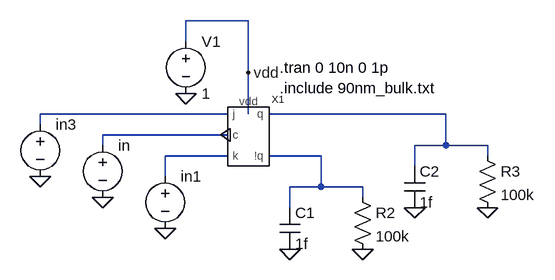
[diagram p0: schematic jk-front-test.asc]
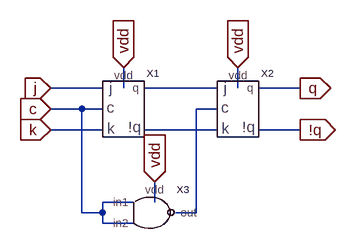
[diagram p1: sub-circuit jk-front-trigger.asc]
jk-front-test.asc, the LTspice schematic file:
Version 4
SHEET 1 2620 680
WIRE 224 0 128 0
WIRE 128 32 128 0
WIRE 224 80 224 0
WIRE 192 144 -96 144
WIRE 224 144 224 80
WIRE 528 144 256 144
WIRE -96 160 -96 144
WIRE 192 176 0 176
WIRE 0 192 0 176
WIRE 528 192 528 144
WIRE 528 192 480 192
WIRE 592 192 528 192
WIRE 192 208 96 208
WIRE 336 208 256 208
WIRE 592 208 592 192
WIRE 480 224 480 192
WIRE 96 240 96 208
WIRE 336 256 336 208
WIRE 336 256 288 256
WIRE 400 256 336 256
WIRE 400 272 400 256
WIRE 288 288 288 256
FLAG 0 272 0
FLAG 288 352 0
FLAG 400 352 0
FLAG 480 288 0
FLAG 592 288 0
FLAG 224 80 vdd
FLAG -96 240 0
FLAG 96 320 0
FLAG 128 112 0
SYMBOL voltage 0 176 R0
WINDOW 123 0 0 Left 2
WINDOW 39 0 0 Left 2
WINDOW 3 22 116 Invisible 2
SYMATTR Value PULSE(0 1 0.5n 10p 10p 1n 2n)
SYMATTR InstName in
SYMBOL res 384 256 R0
SYMATTR InstName R2
SYMATTR Value 100k
SYMBOL cap 272 288 R0
SYMATTR InstName C1
SYMATTR Value 1f
SYMBOL res 576 192 R0
SYMATTR InstName R3
SYMATTR Value 100k
SYMBOL cap 464 224 R0
SYMATTR InstName C2
SYMATTR Value 1f
SYMBOL voltage -96 144 R0
WINDOW 123 0 0 Left 2
WINDOW 39 0 0 Left 2
WINDOW 3 -275 -32 Invisible 2
SYMATTR Value PWL(0n 1 0.01n 1 1n 1 1.01n 0 2n 0 2.01n 0 3n 0 3.01n 0 4n 0 4.01n 0 5n 0 5.01n 1 6n 1 6.01n 0 7n 0 7.01n 1 8n 1 8.01n 1 9n 1 9.01n 0 10n 0 10.01n 0)
SYMATTR InstName in3
SYMBOL voltage 96 224 R0
WINDOW 123 0 0 Left 2
WINDOW 39 0 0 Left 2
WINDOW 3 -21 145 Invisible 2
SYMATTR Value PWL(0n 0 0.01n 0 1n 0 1.01n 0 2n 0 2.01n 0 3n 0 3.01n 1 4n 1 4.01n 0 5n 0 5.01n 0 6n 0 6.01n 0 7n 0 7.01n 1 8n 1 8.01n 1 9n 1 9.01n 0 10n 0)
SYMATTR InstName in1
SYMBOL voltage 128 16 R0
WINDOW 123 0 0 Left 2
WINDOW 39 0 0 Left 2
SYMATTR InstName V1
SYMATTR Value 1
SYMBOL jk-front-trigger 224 176 R0
SYMATTR InstName X1
TEXT 272 104 Left 2 !.include 90nm_bulk.txt
TEXT 272 72 Left 2 !.tran 0 10n 0 1p

jk-front-trigger.asc, the sub-circuit schematic file:
Version 4
SHEET 1 880 680
WIRE 48 128 -32 128
WIRE 80 128 80 96
WIRE 224 128 112 128
WIRE 256 128 256 96
WIRE 352 128 288 128
WIRE 16 160 -32 160
WIRE 48 160 16 160
WIRE 224 160 192 160
WIRE 48 192 -32 192
WIRE 224 192 112 192
WIRE 352 192 288 192
WIRE 96 304 48 304
WIRE 128 304 128 272
WIRE 16 320 16 160
WIRE 48 320 48 304
WIRE 48 320 16 320
WIRE 192 320 192 160
WIRE 192 320 160 320
WIRE 48 336 48 320
WIRE 96 336 48 336
FLAG 256 96 vdd
IOPIN 256 96 In
FLAG 80 96 vdd
IOPIN 80 96 In
FLAG 352 128 q
IOPIN 352 128 Out
FLAG 352 192 !q
IOPIN 352 192 Out
FLAG -32 128 j
IOPIN -32 128 In
FLAG -32 192 k
IOPIN -32 192 In
FLAG -32 160 c
IOPIN -32 160 In
FLAG 128 272 vdd
IOPIN 128 272 In
SYMBOL jk-trigger 80 160 R0
SYMATTR InstName X1
SYMBOL jk-trigger 256 160 R0
SYMATTR InstName X2
SYMBOL nand 112 320 R0
SYMATTR InstName X3

The netlist it stands for:
* jk-front-test.asc
V§in N003 0 PULSE(0 1 0.5n 10p 10p 1n 2n)
R2 N005 0 100k
C1 N005 0 1f
R3 N002 0 100k
C2 N002 0 1f
V§in3 N001 0 PWL(0n 1 0.01n 1 1n 1 1.01n 0 2n 0 2.01n 0 3n 0 3.01n 0 4n 0 4.01n 0 5n 0 5.01n 1 6n 1 6.01n 0 7n 0 7.01n 1 8n 1 8.01n 1 9n 1 9.01n 0 10n 0 10.01n 0)
V§in1 N004 0 PWL(0n 0 0.01n 0 1n 0 1.01n 0 2n 0 2.01n 0 3n 0 3.01n 1 4n 1 4.01n 0 5n 0 5.01n 0 6n 0 6.01n 0 7n 0 7.01n 1 8n 1 8.01n 1 9n 1 9.01n 0 10n 0)
V1 vdd 0 1
XX1 N001 N003 N004 N002 N005 vdd jk-front-trigger

* block symbol definitions
.subckt jk-front-trigger j c k q !q vdd
XX1 k c j vdd N003 N001 jk-trigger  ; pins k c j vdd !q q
XX2 N003 N002 N001 vdd !q q jk-trigger  ; pins k c j vdd !q q
XX3 c c N002 vdd nand  ; pins in1 in2 out vdd
.ends jk-front-trigger

.include 90nm_bulk.txt
.tran 0 10n 0 1p
.backanno
.end